# Altium schematic sheet BME280.SchDoc
size A4; SheetNumber: 3; SheetTotal: 6
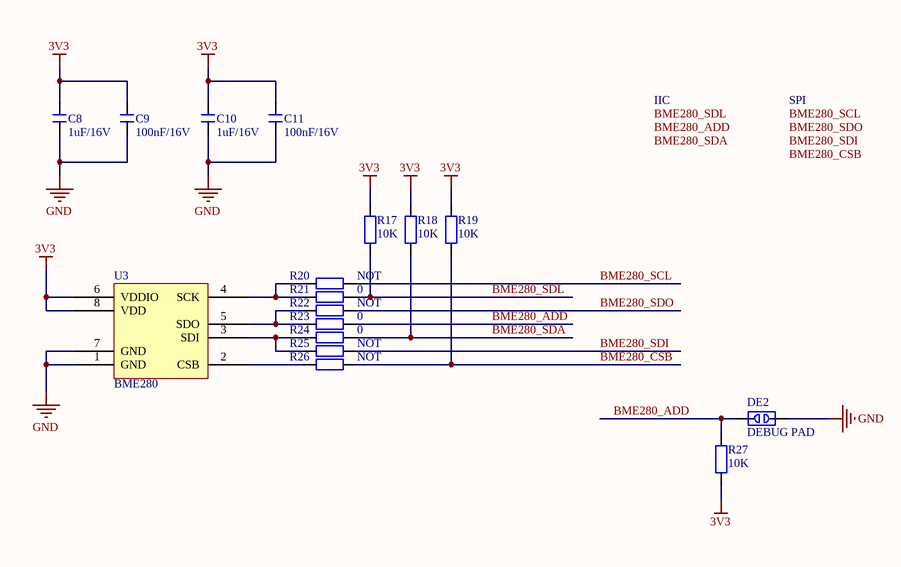
[diagram p0: BME280.SchDoc]

## Parts
C8  1uF/16V  [C 0402_L]
C9  100nF/16V  [C 0402_L]
C10  1uF/16V  [C 0402_L]
C11  100nF/16V  [C 0402_L]
DE2  DEBUG PAD  [DEBUG_A]
R17  10K  [R 0402_L]
R18  10K  [R 0402_L]
R19  10K  [R 0402_L]
R20  NOT  [R 0402_L]
R21  0  [R 0402_L]
R22  NOT  [R 0402_L]
R23  0  [R 0402_L]
R24  0  [R 0402_L]
R25  NOT  [R 0402_L]
R26  NOT  [R 0402_L]
R27  10K  [R 0402_L]
U3  BME280  [BME280]

## Nets
3V3: C8.2 C9.1 C10.2 C11.1 R17.1 R18.1 R19.1 R27.1 U3.6(VDDIO) U3.8(VDD)
GND: C8.1 C9.2 C10.1 C11.2 DE2.2 U3.1(GND) U3.7(GND)
BME280_ADD: DE2.1 R23.1 R27.2
BME280_CSB: R19.2 R26.1
BME280_SCL: R20.1
BME280_SDA: R18.2 R24.1
BME280_SDI: R25.1
BME280_SDL: R17.2 R21.1
BME280_SDO: R22.1
NetR20_2: R20.2 R21.2 U3.4(SCK)
NetR22_2: R22.2 R23.2 U3.5(SDO)
NetR24_2: R24.2 R25.2 U3.3(SDI)
NetR26_2: R26.2 U3.2(CSB)

## Notes on the sheet
- IIC
- SPI
- Labels drawn without touching a wire or pin: BME280_ADD, BME280_CSB, BME280_SCL, BME280_SDA, BME280_SDI, BME280_SDL, BME280_SDO

## Library data of the parts
C8 C10 = C: 贴片电容; 主类型: 电容; 值精度: ±10%; 元件封装: 0402; 具体类型: 陶瓷电容; 封装类型: 贴片; 温度漂移: X5R; 生产商: SAMSUNG(三星); 生产商零件编码: CL05A105KO5NNNC; 值/型号: 1uF/16V; 立创编号: C29266
C9 C11 = C: 无极性贴片电容; 主类型: 电容; 封装类型: 贴片; 生产商: YAGEO(国巨); 生产商零件编码: CC0402KRX7R7BB104; 值/型号: 100nF/16V; 元件封装: *; 具体类型: *; 温度漂移: *; 温度范围: *; 立创编号: C60474; 类型备注: *; 手册网址: *; 官网地址: *
DE2 = DEBUG: 调试断点焊盘; 版权归属: 源创客; BOM名称: 调试断点焊盘; 学习资源: www.ooocke.com
R17-R19 R27 = R: 贴片电阻 0402 1%; 主类型: 电阻; 元件封装: 0402; 封装类型: 贴片; 温度漂移: ±100ppm/℃; 生产商: 国巨; 生产商零件编码: RC0402FR-0710KL; 值/型号: 10K; 值精度: ±1%; 具体类型: 贴片电阻; 立创编号: C60490
R20 R22 R25 R26 = R: 贴片电阻; 主类型: 电阻; 值/型号: 0; 元件封装: 0402; 生产商: YAGEO(国巨); 生产商零件编码: RC0402JR-070RL; 立创编号: C60485
R21 R23 R24 = R: 贴片电阻; 主类型: 电阻; 元件封装: 0402; 生产商: YAGEO(国巨); 生产商零件编码: RC0402JR-070RL; 值/型号: 0; 立创编号: C60485